# Altium project Main.PrjPCB
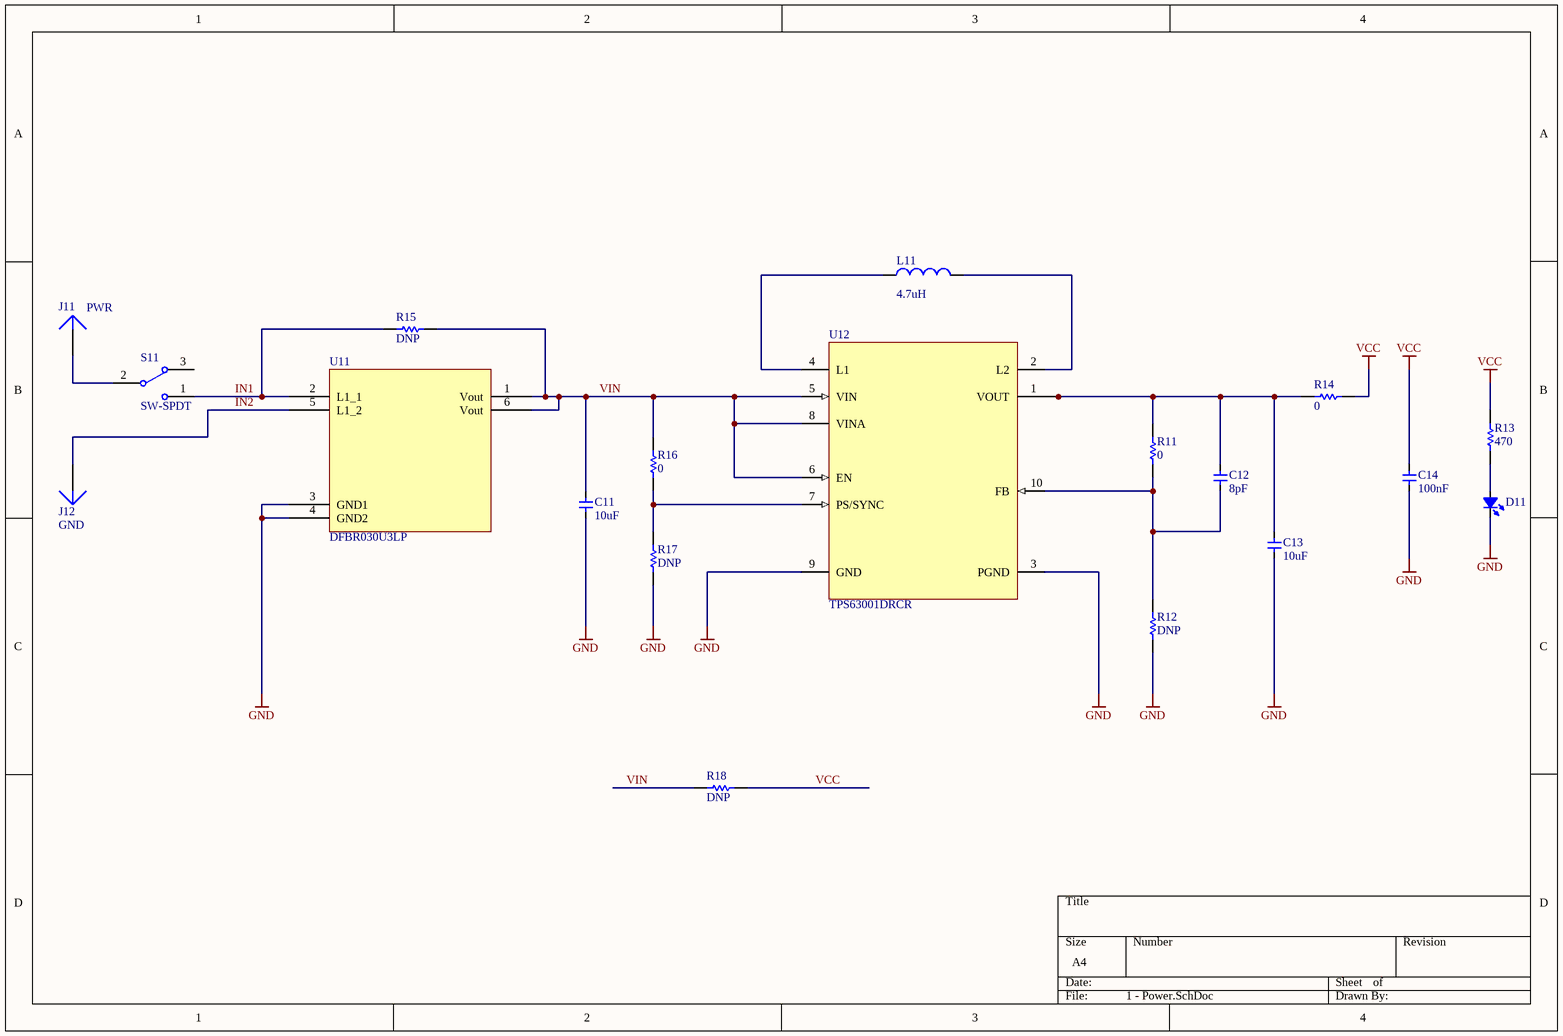
[diagram p0: 1 - Power.SchDoc]
3 sheets, 73 parts. Net scope: global (net labels, ports and power ports of the same name join across sheets).
Board file: PCB.PcbDoc
Sheets:
  1 - Power.SchDoc
  3 - Drivers.SchDoc
  4 - Output.SchDoc

## Sheet 1 - Power.SchDoc
size A4

### Parts
C11  value 10uF  [CAPC2012X135N]  (hidden comment: Cap_0603)
C12  value 8pF  [CAP_0603]  (hidden comment: Cap_0603)
C13  value 10uF  [CAPC2012X135N]  (hidden comment: Cap_0603)
C14  value 100nF  [CAP_0603]  (hidden comment: Cap_0603)
D11  LED_0603  [LED_0603_RED]  (value not drawn)
J11  PWR  [PIN1]
J12  GND  [PIN1]
L11  value 4.7uH  [RES_0805]  (hidden comment: Inductor)
R11  value 0  [RES_0603]  (hidden comment: Res1)
R12  value DNP  [RES_0603]  (hidden comment: Res1)
R13  value 470  [RES_0603]  (hidden comment: Res1)
R14  value 0  [RES_0603]  (hidden comment: Res1)
R15  value DNP  [RES_0603]  (hidden comment: Res1)
R16  value 0  [RES_0603]  (hidden comment: Res1)
R17  value DNP  [RES_0603]  (hidden comment: Res1)
R18  value DNP  [RES_0603]  (hidden comment: Res1)
S11  SW-SPDT  [MSK-12C02]
U11  DFBR030U3LP  [U-DFN4040-8]
U12  TPS63001DRCR  [10-VSON]

### Nets
GND: C11.1 C13.1 C14.1 D11.2(K) R12.1 R17.1 U11.3(GND1) U11.4(GND2) U12.3(PGND) U12.9(GND)
VCC: C14.2 R13.2 R14.1 R18.1
IN1: R15.2 S11.1 U11.2(L1_1)
IN2: J12.1 U11.5(L1_2)
VIN: C11.2 R15.1 R16.2 R18.2 U11.1(Vout) U11.6(Vout) U12.5(VIN) U12.6(EN) U12.8(VINA)
NetC12_1: C12.1 R11.1 R12.2 U12.10(FB)
NetC12_2: C12.2 C13.2 R11.2 R14.2 U12.1(VOUT)
NetD11_1: D11.1(A) R13.1
NetJ11_1: J11.1 S11.2
NetL11_1: L11.1 U12.4(L1)
NetL11_2: L11.2 U12.2(L2)
NetR16_1: R16.1 R17.2 U12.7(PS/SYNC)

Not connected (* = marked no-connect by the designer): S11 3

### Library data of the parts
C11-C14 = Cap_0603: Capacitor
D11 = LED_0603: LED
J11 J12 = Plug: LatestRevisionDate: 17-Jul-2002; LatestRevisionNote: Re-released for DXP Platform.; Publisher: Altium Limited
L11 = Inductor: Code_IEC: 2012; Published: 8-Jun-2000; LatestRevisionDate: 29-May-2009; LatestRevisionNote: IPC-7351 Footprint Added.; PackageReference: 0402-A; Publisher: Altium Limited; PackageDescription: Chip Inductor; Code_JEITA: 0805
R11-R18 = Res1: Resistor; Published: 8-Jun-2000; LatestRevisionDate: 17-Jul-2002; LatestRevisionNote: Re-released for DXP Platform.; PackageReference: AXIAL-0.3; Publisher: Altium Limited; PackageDescription: Axial Device, Thru-Hole; 2 Leads; 0.3 in Pin Spacing
S11 = SW-SPDT: SPDT Subminiature Toggle Switch, Right Angle Mounting, Vertical Actuation; Published: 24-Mar-1999; LatestRevisionDate: 17-Dec-2003; LatestRevisionNote: Schematic revised, PCB Footprint replaced.; DatasheetVersion: 05-Dec-2000; PackageReference: TL36WW15050; Publisher: Altium Limited; PackageDescription: Switch; 4 Leads; ComponentLink1Description: Manufacturer Link; ComponentLink1URL: http://www.apem.com
U11 = DFBR030U3LP: 3A Full Bridge Rectifier
U12 = TPS63001DRCR: Buck-Boost Switching Regulator IC Positive Fixed 3.3V 1 Output 1.6A (Switch) 10-VFDFN Exposed Pad; PackageReference: 10-VSON (3x3); PackageDescription: 10-VFDFN Exposed Pad; Supplier 1: Digi-Key; Supplier Part Number 1: 296-19643-1-ND; ComponentLink1Description: Datasheet; ComponentLink1URL: http://www.ti.com/lit/ds/symlink/tps63001.pdf; ComponentLink2Description: Packaging Specification

## Sheet 3 - Drivers.SchDoc
size A4
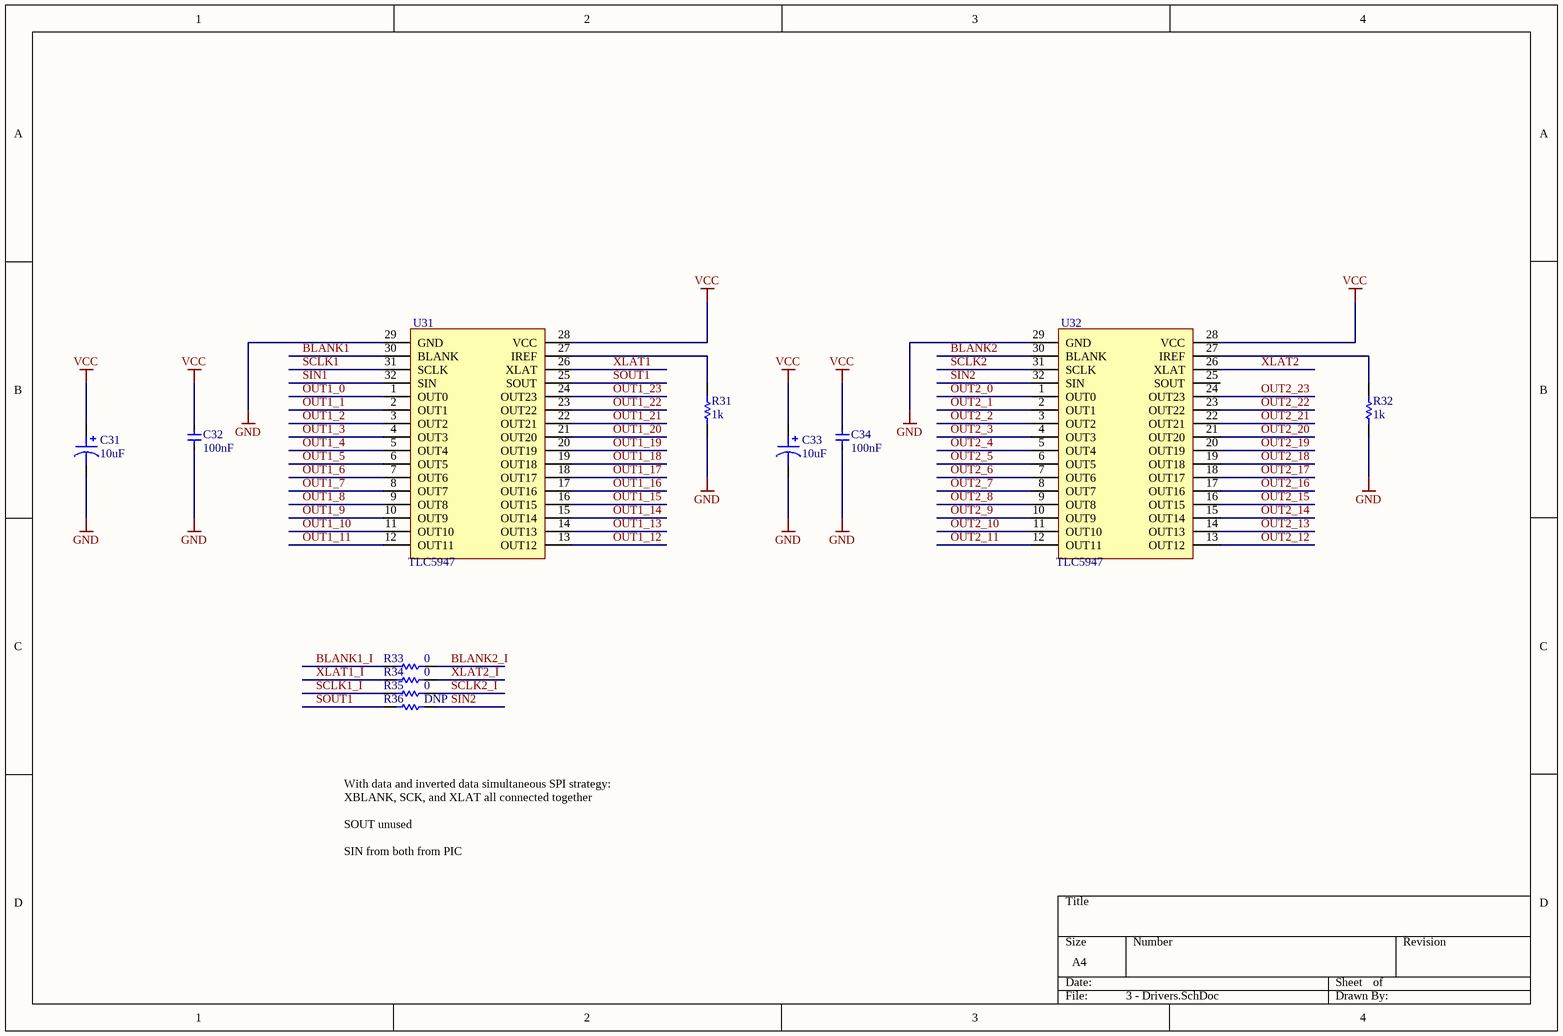
[diagram p1: 3 - Drivers.SchDoc]

### Parts
C31  10uF  [CAP_ELEC_5x5.7]
C32  value 100nF  [CAP 0603/1608]  (hidden comment: Cap_0603)
C33  10uF  [CAP_ELEC_5x5.7]
C34  value 100nF  [CAP 0603/1608]  (hidden comment: Cap_0603)
R31  value 1k  [RES_0603]  (hidden comment: Res1)
R32  value 1k  [RES_0603]  (hidden comment: Res1)
R33  value 0  [RES_0603]  (hidden comment: Res1)
R34  value 0  [RES_0603]  (hidden comment: Res1)
R35  value 0  [RES_0603]  (hidden comment: Res1)
R36  value DNP  [RES_0603]  (hidden comment: Res1)
U31  TLC5947  [QFN50P500X500X100-33N]
U32  TLC5947  [QFN50P500X500X100-33N]

### Nets
GND: C31.2 C32.1 C33.2 C34.1 R31.1 R32.1 U31.29(GND) U32.29(GND)
VCC: C31.1 C32.2 C33.1 C34.2 U31.28(VCC) U32.28(VCC)
BLANK1: U31.30(BLANK)
BLANK1_I: R33.2
BLANK2: U32.30(BLANK)
BLANK2_I: R33.1
OUT1_0: U31.1(OUT0)
OUT1_1: U31.2(OUT1)
OUT1_2: U31.3(OUT2)
OUT1_3: U31.4(OUT3)
OUT1_4: U31.5(OUT4)
OUT1_5: U31.6(OUT5)
OUT1_6: U31.7(OUT6)
OUT1_7: U31.8(OUT7)
OUT1_8: U31.9(OUT8)
OUT1_9: U31.10(OUT9)
OUT1_10: U31.11(OUT10)
OUT1_11: U31.12(OUT11)
OUT1_12: U31.13(OUT12)
OUT1_13: U31.14(OUT13)
OUT1_14: U31.15(OUT14)
OUT1_15: U31.16(OUT15)
OUT1_16: U31.17(OUT16)
OUT1_17: U31.18(OUT17)
OUT1_18: U31.19(OUT18)
OUT1_19: U31.20(OUT19)
OUT1_20: U31.21(OUT20)
OUT1_21: U31.22(OUT21)
OUT1_22: U31.23(OUT22)
OUT1_23: U31.24(OUT23)
OUT2_0: U32.1(OUT0)
OUT2_1: U32.2(OUT1)
OUT2_2: U32.3(OUT2)
OUT2_3: U32.4(OUT3)
OUT2_4: U32.5(OUT4)
OUT2_5: U32.6(OUT5)
OUT2_6: U32.7(OUT6)
OUT2_7: U32.8(OUT7)
OUT2_8: U32.9(OUT8)
OUT2_9: U32.10(OUT9)
OUT2_10: U32.11(OUT10)
OUT2_11: U32.12(OUT11)
OUT2_12: U32.13(OUT12)
OUT2_13: U32.14(OUT13)
OUT2_14: U32.15(OUT14)
OUT2_15: U32.16(OUT15)
OUT2_16: U32.17(OUT16)
OUT2_17: U32.18(OUT17)
OUT2_18: U32.19(OUT18)
OUT2_19: U32.20(OUT19)
OUT2_20: U32.21(OUT20)
OUT2_21: U32.22(OUT21)
OUT2_22: U32.23(OUT22)
OUT2_23: U32.24(OUT23)
SCLK1: U31.31(SCLK)
SCLK1_I: R35.2
SCLK2: U32.31(SCLK)
SCLK2_I: R35.1
SIN1: U31.32(SIN)
SIN2: R36.1 U32.32(SIN)
SOUT1: R36.2 U31.25(SOUT)
XLAT1: U31.26(XLAT)
XLAT1_I: R34.2
XLAT2: U32.26(XLAT)
XLAT2_I: R34.1
NetR31_2: R31.2 U31.27(IREF)
NetR32_2: R32.2 U32.27(IREF)

Not connected (* = marked no-connect by the designer): U31 33(GND); U32 25(SOUT) 33(GND)

### Notes on the sheet
- With data and inverted data simultaneous SPI strategy:
  XBLANK, SCK, and XLAT all connected together
  SOUT unused
  SIN from both from PIC

### Library data of the parts
C31 C33 = Polarised Capacitor: SMT Polarised Capacitor; Value: 10uF
C32 C34 = Cap_0603: Capacitor
R31-R36 = Res1: Resistor; Published: 8-Jun-2000; LatestRevisionDate: 17-Jul-2002; LatestRevisionNote: Re-released for DXP Platform.; PackageReference: AXIAL-0.3; Publisher: Altium Limited; PackageDescription: Axial Device, Thru-Hole; 2 Leads; 0.3 in Pin Spacing
U31 U32 = TLC5947: LED Driver

## Sheet 4 - Output.SchDoc
size A4
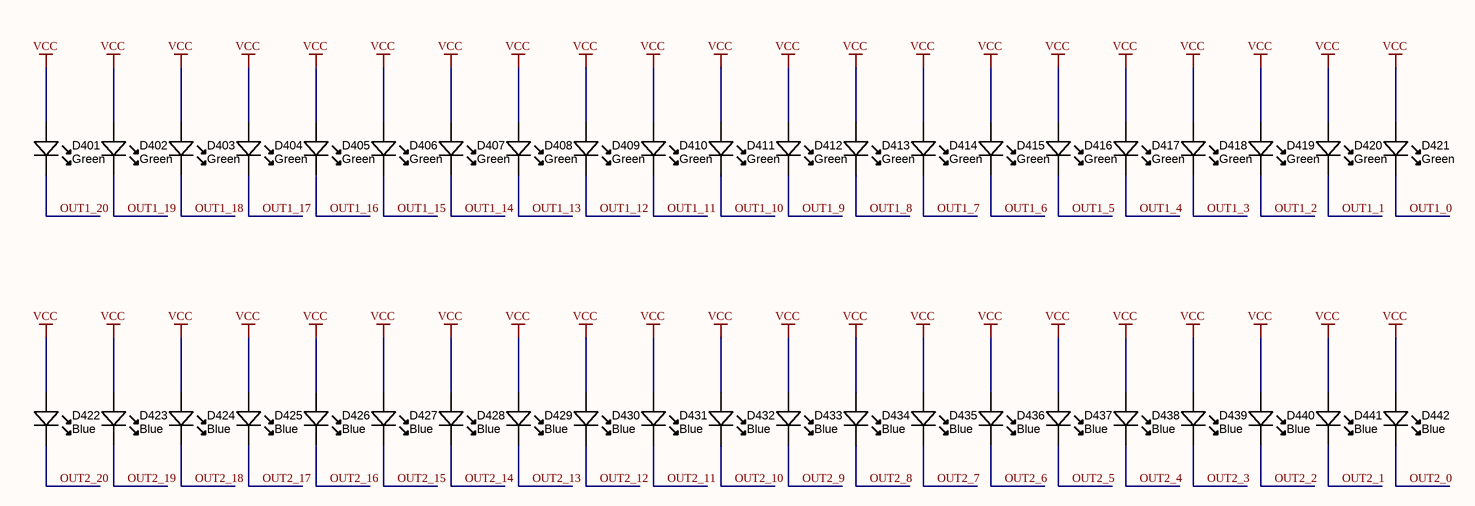
[diagram p2: 4 - Output.SchDoc]

### Parts
D401  Green  [LED-0805S-SIDELED-2.1X0.6X1.0]
D402  Green  [LED-0805S-SIDELED-2.1X0.6X1.0]
D403  Green  [LED-0805S-SIDELED-2.1X0.6X1.0]
D404  Green  [LED-0805S-SIDELED-2.1X0.6X1.0]
D405  Green  [LED-0805S-SIDELED-2.1X0.6X1.0]
D406  Green  [LED-0805S-SIDELED-2.1X0.6X1.0]
D407  Green  [LED-0805S-SIDELED-2.1X0.6X1.0]
D408  Green  [LED-0805S-SIDELED-2.1X0.6X1.0]
D409  Green  [LED-0805S-SIDELED-2.1X0.6X1.0]
D410  Green  [LED-0805S-SIDELED-2.1X0.6X1.0]
D411  Green  [LED-0805S-SIDELED-2.1X0.6X1.0]
D412  Green  [LED-0805S-SIDELED-2.1X0.6X1.0]
D413  Green  [LED-0805S-SIDELED-2.1X0.6X1.0]
D414  Green  [LED-0805S-SIDELED-2.1X0.6X1.0]
D415  Green  [LED-0805S-SIDELED-2.1X0.6X1.0]
D416  Green  [LED-0805S-SIDELED-2.1X0.6X1.0]
D417  Green  [LED-0805S-SIDELED-2.1X0.6X1.0]
D418  Green  [LED-0805S-SIDELED-2.1X0.6X1.0]
D419  Green  [LED-0805S-SIDELED-2.1X0.6X1.0]
D420  Green  [LED-0805S-SIDELED-2.1X0.6X1.0]
D421  Green  [LED-0805S-SIDELED-2.1X0.6X1.0]
D422  Blue  [LED-0805S-SIDELED-2.1X0.6X1.0]
D423  Blue  [LED-0805S-SIDELED-2.1X0.6X1.0]
D424  Blue  [LED-0805S-SIDELED-2.1X0.6X1.0]
D425  Blue  [LED-0805S-SIDELED-2.1X0.6X1.0]
D426  Blue  [LED-0805S-SIDELED-2.1X0.6X1.0]
D427  Blue  [LED-0805S-SIDELED-2.1X0.6X1.0]
D428  Blue  [LED-0805S-SIDELED-2.1X0.6X1.0]
D429  Blue  [LED-0805S-SIDELED-2.1X0.6X1.0]
D430  Blue  [LED-0805S-SIDELED-2.1X0.6X1.0]
D431  Blue  [LED-0805S-SIDELED-2.1X0.6X1.0]
D432  Blue  [LED-0805S-SIDELED-2.1X0.6X1.0]
D433  Blue  [LED-0805S-SIDELED-2.1X0.6X1.0]
D434  Blue  [LED-0805S-SIDELED-2.1X0.6X1.0]
D435  Blue  [LED-0805S-SIDELED-2.1X0.6X1.0]
D436  Blue  [LED-0805S-SIDELED-2.1X0.6X1.0]
D437  Blue  [LED-0805S-SIDELED-2.1X0.6X1.0]
D438  Blue  [LED-0805S-SIDELED-2.1X0.6X1.0]
D439  Blue  [LED-0805S-SIDELED-2.1X0.6X1.0]
D440  Blue  [LED-0805S-SIDELED-2.1X0.6X1.0]
D441  Blue  [LED-0805S-SIDELED-2.1X0.6X1.0]
D442  Blue  [LED-0805S-SIDELED-2.1X0.6X1.0]

### Nets
VCC: D401.A D402.A D403.A D404.A D405.A D406.A D407.A D408.A D409.A D410.A D411.A D412.A D413.A D414.A D415.A D416.A D417.A D418.A D419.A D420.A D421.A D422.A D423.A D424.A D425.A D426.A D427.A D428.A D429.A D430.A D431.A D432.A D433.A D434.A D435.A D436.A D437.A D438.A D439.A D440.A D441.A D442.A
OUT1_0: D421.K
OUT1_1: D420.K
OUT1_2: D419.K
OUT1_3: D418.K
OUT1_4: D417.K
OUT1_5: D416.K
OUT1_6: D415.K
OUT1_7: D414.K
OUT1_8: D413.K
OUT1_9: D412.K
OUT1_10: D411.K
OUT1_11: D410.K
OUT1_12: D409.K
OUT1_13: D408.K
OUT1_14: D407.K
OUT1_15: D406.K
OUT1_16: D405.K
OUT1_17: D404.K
OUT1_18: D403.K
OUT1_19: D402.K
OUT1_20: D401.K
OUT2_0: D442.K
OUT2_1: D441.K
OUT2_2: D440.K
OUT2_3: D439.K
OUT2_4: D438.K
OUT2_5: D437.K
OUT2_6: D436.K
OUT2_7: D435.K
OUT2_8: D434.K
OUT2_9: D433.K
OUT2_10: D432.K
OUT2_11: D431.K
OUT2_12: D430.K
OUT2_13: D429.K
OUT2_14: D428.K
OUT2_15: D427.K
OUT2_16: D426.K
OUT2_17: D425.K
OUT2_18: D424.K
OUT2_19: D423.K
OUT2_20: D422.K

### Library data of the parts
D401-D442 = LED_SMD_PureGreen_0805RA_250mcd: LED 0805 SIDELED SMD Green 250mcd 525nm; Manufacturer 1: Kingbright Corp; Manufacturer Part Number 1: APA2106ZGC; Material: InGaN; Ratings: 250 mcd; 525 nm; SCDType: source; Package / Case: 2.1x0.6x1.0mm SIDELED; Supplier 1: Digi-Key; Supplier Part Number 1: 754-1062-1-ND
  D401-D421: Value: Green; Color: Green
  D422-D442: Value: Blue; Color: Blue

## Nets that join several sheets
GND: 1 - Power (10 pins), 3 - Drivers (8 pins)
VCC: 1 - Power (C14.2 R13.2 R14.1 R18.1), 3 - Drivers (6 pins), 4 - Output (42 pins)
OUT1_0: 3 - Drivers (U31.1), 4 - Output (D421.K)
OUT1_1: 3 - Drivers (U31.2), 4 - Output (D420.K)
OUT1_2: 3 - Drivers (U31.3), 4 - Output (D419.K)
OUT1_3: 3 - Drivers (U31.4), 4 - Output (D418.K)
OUT1_4: 3 - Drivers (U31.5), 4 - Output (D417.K)
OUT1_5: 3 - Drivers (U31.6), 4 - Output (D416.K)
OUT1_6: 3 - Drivers (U31.7), 4 - Output (D415.K)
OUT1_7: 3 - Drivers (U31.8), 4 - Output (D414.K)
OUT1_8: 3 - Drivers (U31.9), 4 - Output (D413.K)
OUT1_9: 3 - Drivers (U31.10), 4 - Output (D412.K)
OUT1_10: 3 - Drivers (U31.11), 4 - Output (D411.K)
OUT1_11: 3 - Drivers (U31.12), 4 - Output (D410.K)
OUT1_12: 3 - Drivers (U31.13), 4 - Output (D409.K)
OUT1_13: 3 - Drivers (U31.14), 4 - Output (D408.K)
OUT1_14: 3 - Drivers (U31.15), 4 - Output (D407.K)
OUT1_15: 3 - Drivers (U31.16), 4 - Output (D406.K)
OUT1_16: 3 - Drivers (U31.17), 4 - Output (D405.K)
OUT1_17: 3 - Drivers (U31.18), 4 - Output (D404.K)
OUT1_18: 3 - Drivers (U31.19), 4 - Output (D403.K)
OUT1_19: 3 - Drivers (U31.20), 4 - Output (D402.K)
OUT1_20: 3 - Drivers (U31.21), 4 - Output (D401.K)
OUT2_0: 3 - Drivers (U32.1), 4 - Output (D442.K)
OUT2_1: 3 - Drivers (U32.2), 4 - Output (D441.K)
OUT2_2: 3 - Drivers (U32.3), 4 - Output (D440.K)
OUT2_3: 3 - Drivers (U32.4), 4 - Output (D439.K)
OUT2_4: 3 - Drivers (U32.5), 4 - Output (D438.K)
OUT2_5: 3 - Drivers (U32.6), 4 - Output (D437.K)
OUT2_6: 3 - Drivers (U32.7), 4 - Output (D436.K)
OUT2_7: 3 - Drivers (U32.8), 4 - Output (D435.K)
OUT2_8: 3 - Drivers (U32.9), 4 - Output (D434.K)
OUT2_9: 3 - Drivers (U32.10), 4 - Output (D433.K)
OUT2_10: 3 - Drivers (U32.11), 4 - Output (D432.K)
OUT2_11: 3 - Drivers (U32.12), 4 - Output (D431.K)
OUT2_12: 3 - Drivers (U32.13), 4 - Output (D430.K)
OUT2_13: 3 - Drivers (U32.14), 4 - Output (D429.K)
OUT2_14: 3 - Drivers (U32.15), 4 - Output (D428.K)
OUT2_15: 3 - Drivers (U32.16), 4 - Output (D427.K)
OUT2_16: 3 - Drivers (U32.17), 4 - Output (D426.K)
OUT2_17: 3 - Drivers (U32.18), 4 - Output (D425.K)
OUT2_18: 3 - Drivers (U32.19), 4 - Output (D424.K)
OUT2_19: 3 - Drivers (U32.20), 4 - Output (D423.K)
OUT2_20: 3 - Drivers (U32.21), 4 - Output (D422.K)